# EAGLE schematic mtc2-n9151-breakout_EAGLE (EAGLE 7.5.0)
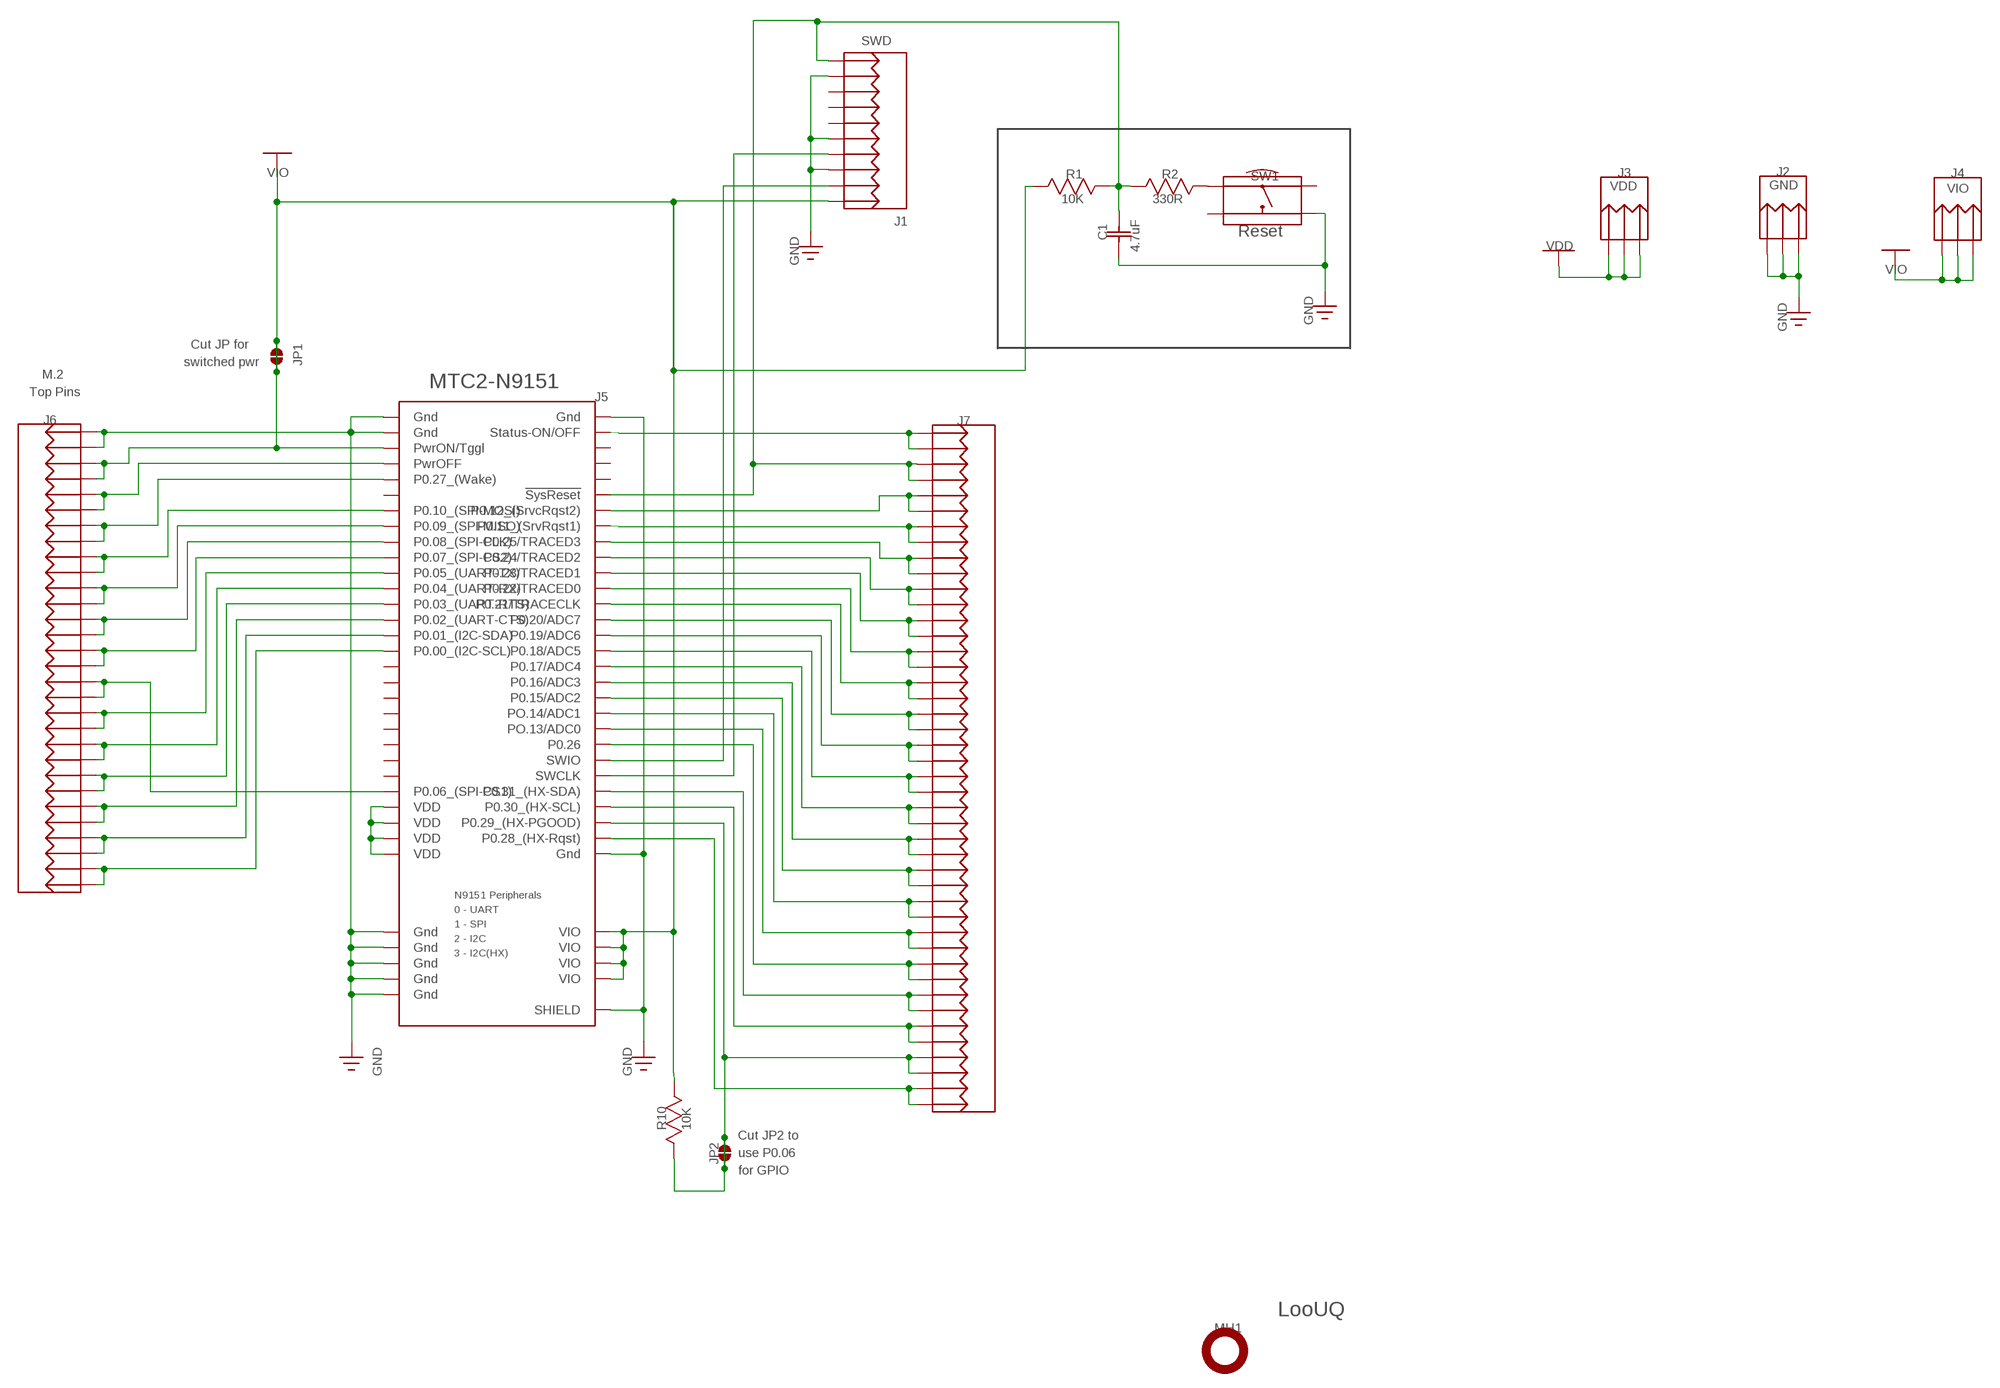
[diagram p0: schematic, sheet 1]

## Parts
C1  4.7uF  CL10A475KP8NNNC  [CAP_0603]
J1  CNCTECH_3220-10-0300-00-TR  [CNCTECH_3220-10-0300-00-TR]
J2  644456-3  [HDR-1X3T/2.54/7X2]
J3  644456-3  [HDR-1X3T/2.54/7X2]
J4  644456-3  [HDR-1X3T/2.54/7X2]
J5  MTC.2_1-2199230-6_(N9151)  [TE_1-2199230-6]
J6  DEV_J6  [HDR-2X15T/2.54X2.54/38X5]
J7  DEV_J7  [HDR-2X22T/2.54X2.54/56X5]
JP1  CIRCJUMPER-2  [CIRC-JUMPER-2]
JP2  CIRCJUMPER-2  [CIRC-JUMPER-2]
LG1  LOOUQ_LOGO  [LOOUQ-6MM]
MH1  9774025151R  [M.2_STANDOFF]
R1  10K  RNCP0603FTD10K0  [RES_0603]
R2  330R  WR06X3300FTL  [RES_0603]
R10  10K  RNCP0603FTD10K0  [RES_0603]
SW1  KMR221GLFS  [KMR-2-WG]

## Nets
ND_RESETSW: R2.2 SW1.1@_1
Net_GND: C1.1 J1.3 J1.5 J1.9 J2.1 J2.2 J2.3 J5.1(Gnd) J5.2(Gnd) J5.3(Gnd) J5.58(Gnd) J5.67(Gnd) J5.69(Gnd) J5.71(Gnd) J5.73(Gnd) J5.75(Gnd) J5.S1(SHIELD) J5.S2(SHIELD) J6.1 J6.2 SW1.2@_1 ; supply symbol labelled GND
Net_SWCLK: J1.4 J5.48(SWCLK)
Net_SWIO: J1.2 J5.46(SWIO)
Net_VDD: J3.1 J3.2 J3.3 J5.51(VDD) J5.53(VDD) J5.55(VDD) J5.57(VDD) ; supply symbol labelled VDD
Net_VIO [NetClass2]: J1.1 J4.1 J4.2 J4.3 J5.5(PwrON/Tggl) J5.68(VIO) J5.70(VIO) J5.72(VIO) J5.74(VIO) J6.3 J6.4 JP1.1 JP1.2 R1.2 R10.2 ; supply symbol labelled VIO
nSysReset: C1.2 J1.10 J5.12(!SysReset) J7.41 J7.42 R1.1 R2.1
P0.00_I2C-SCL: J5.31(P0.00_(I2C-SCL)) J6.29 J6.30
P0.01_I2C-SDA: J5.29(P0.01_(I2C-SDA)) J6.27 J6.28
P0.02_UART-CTS: J5.27(P0.02_(UART-CTS)) J6.25 J6.26
P0.03_UART-RTS: J5.25(P0.03_(UART-RTS)) J6.23 J6.24
P0.04_UART-RX: J5.23(P0.04_(UART-RX)) J6.21 J6.22
P0.05_UART-TX: J5.21(P0.05_(UART-TX)) J6.19 J6.20
P0.06_SPI-CS1: J5.49(P0.06_(SPI-CS1)) J6.17 J6.18
p0.07_SPI-CS2: J5.19(P0.07_(SPI-CS2)) J6.15 J6.16
P0.08_SPI-CLK: J5.17(P0.08_(SPI-CLK)) J6.13 J6.14
P0.09_SPI-MISO: J5.15(P0.09_(SPI-MISO)) J6.11 J6.12
P0.10_SPI-MOSI: J5.13(P0.10_(SPI-MOSI)) J6.9 J6.10
P0.11_SrvcRqst1: J5.16(P0.11_(SrvRqst1)) J7.37 J7.38
P0.12_SrvcRqst2: J5.14(P0.12_(SrvcRqst2)) J7.39 J7.40
P0.13_ADC0: J5.42(PO.13/ADC0) J7.11 J7.12
P0.14_ADC1: J5.40(PO.14/ADC1) J7.13 J7.14
P0.15_ADC2: J5.38(P0.15/ADC2) J7.15 J7.16
P0.16_ADC3: J5.36(P0.16/ADC3) J7.17 J7.18
P0.17_ADC4: J5.34(P0.17/ADC4) J7.19 J7.20
P0.18_ADC5: J5.32(P0.18/ADC5) J7.21 J7.22
P0.19_ADC6: J5.30(P0.19/ADC6) J7.23 J7.24
P0.20_ADC7: J5.28(P0.20/ADC7) J7.25 J7.26
P0.21_TraceClk: J5.26(P0.21/TRACECLK) J7.27 J7.28
P0.22_TraceD0: J5.24(P0.22/TRACED0) J7.29 J7.30
P0.23_TraceD1: J5.22(P0.23/TRACED1) J7.31 J7.32
P0.24_TraceD2: J5.20(P0.24/TRACED2) J7.33 J7.34
P0.25_TraceD3: J5.18(P0.25/TRACED3) J7.35 J7.36
P0.26: J5.44(P0.26) J7.9 J7.10
P0.27_WAKE: J5.9(P0.27_(Wake)) J6.7 J6.8
P0.28_(HX-Rqst): J5.56(P0.28_(HX-Rqst)) J7.1 J7.2
P0.29_(HX-PGOOD): J5.54(P0.29_(HX-PGOOD)) J7.3 J7.4 JP2.1 JP2.2 R10.1
P0.30_HX-SCL: J5.52(P0.30_(HX-SCL)) J7.5 J7.6
P0.31_HX-SDA: J5.50(P0.31_(HX-SDA)) J7.7 J7.8
PwrOFF: J5.7(PwrOFF) J6.5 J6.6
PwrStatus: J5.4(Status-ON/OFF) J7.43 J7.44
Unconnected: J1.6 J1.7 J1.8 J5.6(Status-Rdy) J5.8(StatusActv0) J5.10(StatusActv1) J5.11 J5.33(UDPIN0) J5.35(UDPIN1) J5.37(UDPIN2) J5.39(UDPIN3) J5.41(UDPIN4) J5.43(UDPIN5) J5.45(UDPIN6) J5.47(UDPIN7) SW1.1@_1 SW1.2@_1

## Notes on the sheet
- SWD
- VIO | R1 | R2 | J3 | J2 | J4
- SW1 | VDD | GND | VIO
- 10K | 330R
- J1 | Reset
- C1
- 4.7uF | VDD
- GND
- VIO
- GND
- GND
- Cut JP for 
  switched pwr
- JP1
- M.2 
  Top Pins
- MTC2-N9151
- J5
- J6 | J7
- N9151 Peripherals
  0 - UART
  1 - SPI
  2 - I2C
  3 - I2C(HX)
- GND | GND
- R10 | 10K
- Cut JP2 to
  use P0.06
  for GPIO
- JP2
- LooUQ
- MH1

## Library data of the parts
C1 = common:CL10A475KP8NNNC; MANUFACTURER: Samsung; MFGPARTNM: CAP CER 4.7UF 10V X5R 0603
J1 = common:CNCTECH_3220-10-0300-00-TR; MANUFACTURER: CnCTech
J2-J4 = common:644456-3; DATASHEET: http://datasheets.diptrace.com/con_headers/ENG_CD_644456_D2.pdf; MANUFACTURER: TE Connectivity; MOUNT: TH
J5 = common:MTC.2_1-2199230-6_(N9151); AVAILABILITY: In Stock; CENTERLINE_PITCH: .5 mm[.0197 in]; CHECK_PRICES: https://www.snapeda.com/parts/1-2199230-6/TE+Connectivity+AMP+Connectors/view-part/?ref=eda; COMMENT: 1-2199230-6; DESCRIPTION: 67 Position Female Connector M.2 (NGFF) Mini Card Gold 0.020 (0.50mm) Black; MANUFACTURER: TE Connectivity; MF: TE Connectivity; MP: 1-2199230-6; NUMBER_OF_POSITIONS: 67; PACKAGE: None; PRICE: None; PRODUCT_TYPE: Socket; SNAPEDA_LINK: https://www.snapeda.com/parts/1-2199230-6/TE+Connectivity+AMP+Connectors/view-part/?ref=snap
J6 = common:DEV_J6; MOUNT: TH
J7 = common:DEV_J7; DATASHEET: http://datasheets.diptrace.com/con_headers/877582816_sd.pdf; MOUNT: TH
JP1 JP2 = common:CIRCJUMPER-2; MOUNT: TR
LG1 = common:LOOUQ_LOGO; DESCRIPTION: LooUQ logo silk; MANUFACTURER: PCB; MOUNT: SLK
MH1 = common:9774025151R; DATASHEET: https://www.we-online.com/components/products/datasheet/9774025151R.pdf; MANUFACTURER: Wurth
R1 R10 = common:RNCP0603FTD10K0; MANUFACTURER: Stackpole
R2 = common:WR06X3300FTL; MANUFACTURER: Walsin Technology
SW1 = common:KMR221GLFS; CLASS: Switch; DATASHEET: https://www.ckswitches.com/media/1479/kmr2.pdf; DESCRIPTION: Tactile Switch SPST-NO Top Actuated Surface Mount, GndPin, 300gf; MANUFACTURER: C&K

## Net classes
0 Default: width 0.18 mm, clearance 0.2 mm
1 Power: width 0.4 mm, clearance 0.2 mm
2 NetClass2: width 0.3 mm, clearance 0.2 mm
3 Power-HI: width 0.6 mm, clearance 0.2 mm